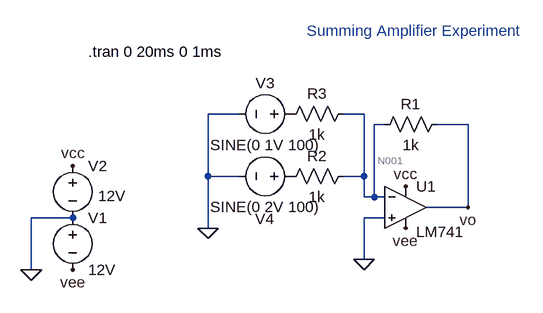
[diagram p0: schematic summing_amplifier.asc]
summing_amplifier.asc, the LTspice schematic file:
Version 4.1
SHEET 1 880 680
WIRE 208 208 160 208
WIRE 400 208 368 208
WIRE 432 224 416 224
WIRE 560 224 512 224
WIRE 160 304 160 208
WIRE 208 304 160 304
WIRE 400 304 400 208
WIRE 400 304 368 304
WIRE 400 336 400 304
WIRE 416 336 416 224
WIRE 416 336 400 336
WIRE 432 336 416 336
WIRE 560 352 560 224
WIRE 560 352 496 352
WIRE -48 368 -112 368
WIRE 432 368 400 368
WIRE 160 384 160 304
WIRE 400 432 400 368
WIRE -112 448 -112 368
FLAG -112 448 0
FLAG -48 288 vcc
FLAG -48 448 vee
FLAG 464 320 vcc
FLAG 464 384 vee
FLAG 560 352 vo
FLAG 400 432 0
FLAG 160 384 0
SYMBOL voltage -48 352 R0
WINDOW 123 0 0 Left 0
WINDOW 39 0 0 Left 0
SYMATTR InstName V1
SYMATTR Value 12V
SYMBOL voltage -48 272 R0
WINDOW 3 39 62 Left 2
WINDOW 123 0 0 Left 0
WINDOW 39 0 0 Left 0
SYMATTR InstName V2
SYMATTR Value 12V
SYMBOL LM741 464 288 R0
WINDOW 3 16 102 Left 2
SYMATTR InstName U1
SYMBOL res 528 208 R90
WINDOW 0 0 56 VBottom 2
WINDOW 3 32 56 VTop 2
SYMATTR InstName R1
SYMATTR Value 1k
SYMBOL res 384 288 R90
WINDOW 0 0 56 VBottom 2
WINDOW 3 32 56 VTop 2
SYMATTR InstName R2
SYMATTR Value 1k
SYMBOL res 384 192 R90
WINDOW 0 0 56 VBottom 2
WINDOW 3 32 56 VTop 2
SYMATTR InstName R3
SYMATTR Value 1k
SYMBOL voltage 304 208 R90
WINDOW 0 -32 56 VBottom 2
WINDOW 3 32 56 VTop 2
WINDOW 123 0 0 Left 0
WINDOW 39 0 0 Left 0
SYMATTR InstName V3
SYMATTR Value SINE(0 1V 100)
SYMBOL voltage 304 304 R90
WINDOW 0 81 57 VBottom 2
WINDOW 3 32 56 VTop 2
WINDOW 123 0 0 Left 0
WINDOW 39 0 0 Left 0
SYMATTR InstName V4
SYMATTR Value SINE(0 2V 100)
TEXT 312 80 Left 2 ;Summing Amplifier Experiment
TEXT -24 112 Left 2 !.tran 0 20ms 0 1ms

The netlist it stands for:
* summing_amplifier.asc
V1 0 vee 12V
V2 vcc 0 12V
X§U1 0 N001 vcc vee vo LM741  ; pins In+ In- V+ V- OUT
R1 vo N001 1k
R2 N001 P001 1k
R3 N001 P002 1k
V3 P002 0 SINE(0 1V 100)
V4 P001 0 SINE(0 2V 100)
* Summing Amplifier Experiment
.tran 0 20ms 0 1ms
.lib LM741.lib
.backanno
.end

* Results of the author's LTspice run, read from the files saved beside the schematic
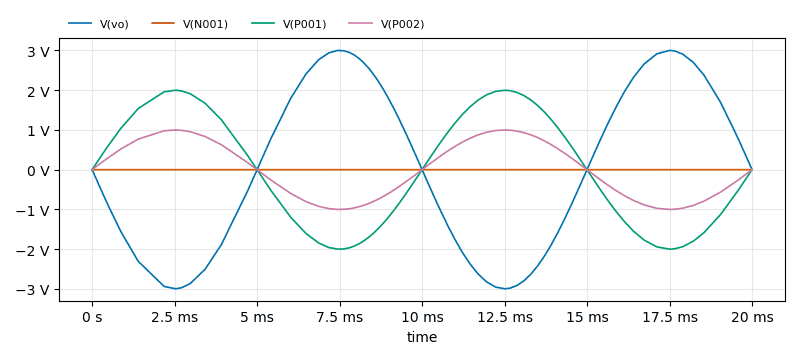
[diagram p1: Transient Analysis of summing_amplifier.asc, plotted from the saved traces]
* Transient Analysis, 1 run:
*   V(vo): min -2.997 V, max 3.003 V, average 5.366 mV, rms 2.124 V, last 4.115 mV
*   V(N001): min 650 µV, max 1.358 mV, average 1 mV, rms 1.025 mV, last 1.337 mV
*   V(P001): min -2 V, max 2 V, average -1.509 mV, rms 1.416 V, last 0 V
*   V(P002): min -1 V, max 1 V, average -754.6 µV, rms 708 mV, last 0 V